# Altium project SVPXFMC_Carrier_6U.PrjPcb (part 7 of 9)

## Sheet Interface_Protection.SchDoc
size A4; Organization: Creotech Instruments; Address1: Gen. L. Okulickiego 7/9; Address2: 05-500 Piaseczno; Address3: Poland
Used 2 times, as channels Interface_prot_A, Interface_prot_B. Parts and nets are listed once, with the designators drawn on the sheet.
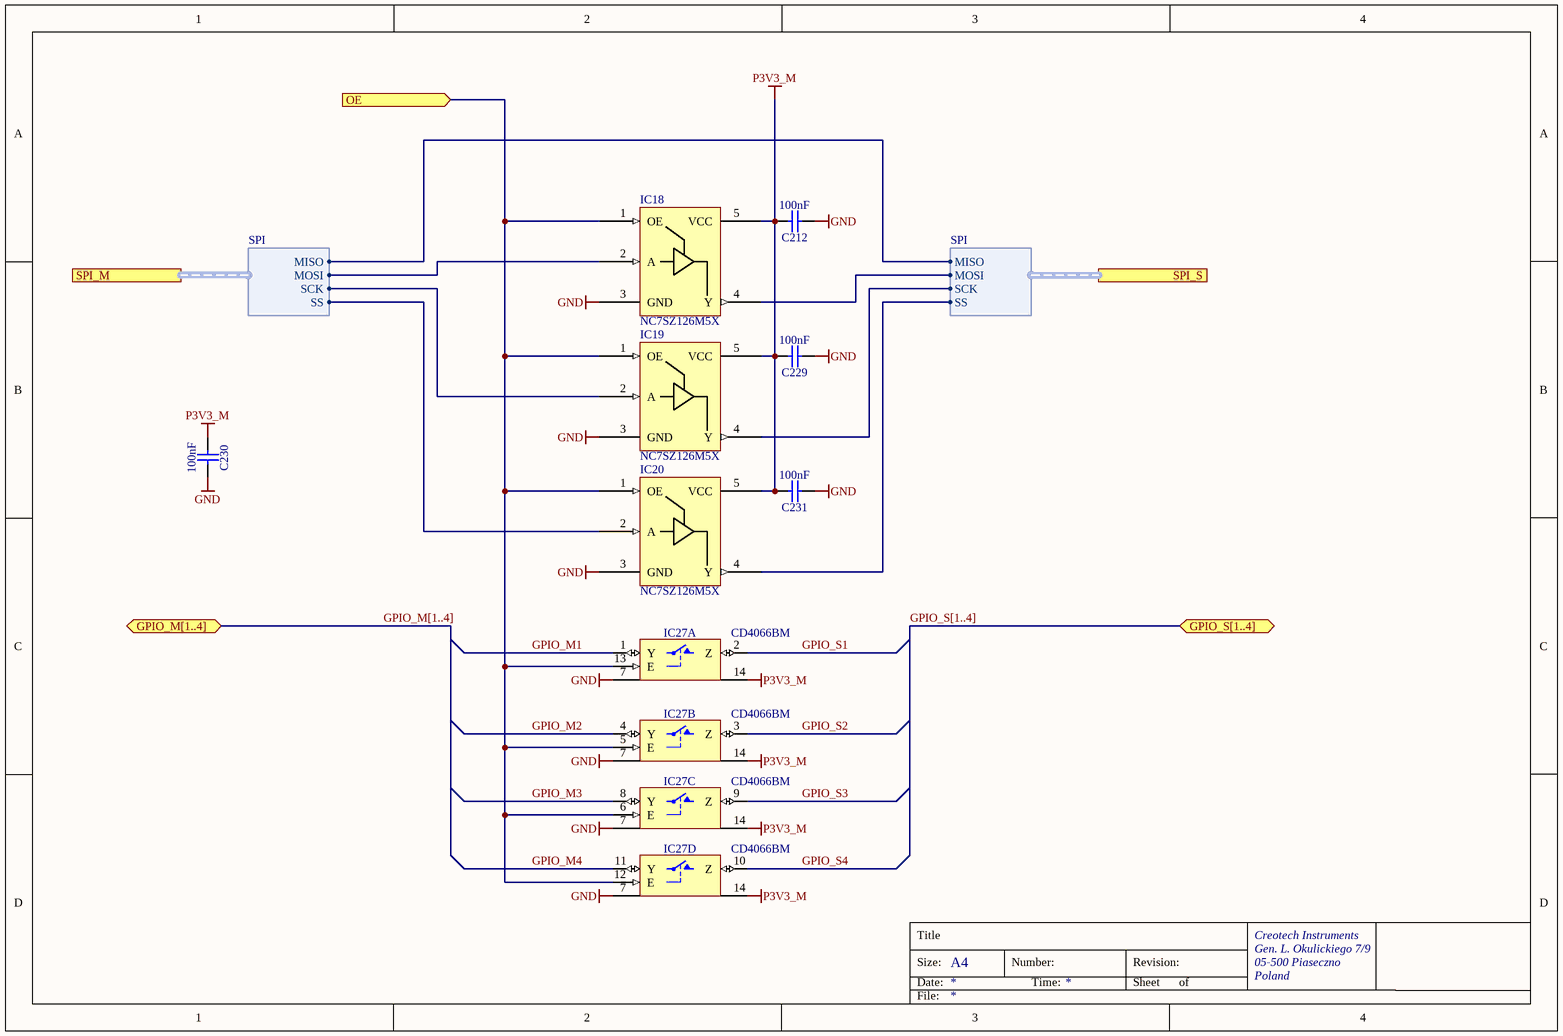
[diagram p22: Interface_Protection.SchDoc]

### Parts
C212  100nF  [CAPC1608X87N]
C229  100nF  [CAPC1608X87N]
C230  100nF  [CAPC1608X87N]
C231  100nF  [CAPC1608X87N]
IC18  NC7SZ126M5X  [SOT95P280X145-5N]
IC19  NC7SZ126M5X  [SOT95P280X145-5N]
IC20  NC7SZ126M5X  [SOT95P280X145-5N]
IC27  CD4066BM  [SOIC127P600X175-14N]  (parts A,B,C,D of 4)

### Ports
GPIO_M[1..4] (bidir), GPIO_S[1..4] (bidir), OE (in), SPI_M (harness SPI), SPI_S (harness SPI)

### Harnesses
SPI: MISO, MOSI, SCK, SS

### Nets
GND: C212.1 C229.1 C230.2 C231.1 IC18.3(GND) IC19.3(GND) IC20.3(GND) IC27.7(VSS)
P3V3_M: C212.2 C229.2 C230.1 C231.2 IC18.5(VCC) IC19.5(VCC) IC20.5(VCC) IC27.14(VDD)  [also labelled VDD]
GPIO_M1: IC27.1(Y)
GPIO_M2: IC27.4(Y)
GPIO_M3: IC27.8(Y)
GPIO_M4: IC27.11(Y)
GPIO_S1: IC27.2(Z)
GPIO_S2: IC27.3(Z)
GPIO_S3: IC27.9(Z)
GPIO_S4: IC27.10(Z)
OE: IC18.1(OE) IC19.1(OE) IC20.1(OE) IC27.5(E) IC27.6(E) IC27.12(E) IC27.13(E) ; port OE
NetIC18_2: IC18.2(A) ; port SPI_M.MOSI
NetIC18_4: IC18.4(Y) ; port SPI_S.MOSI
NetIC19_2: IC19.2(A) ; port SPI_M.SCK
NetIC19_4: IC19.4(Y) ; port SPI_S.SCK
NetIC20_2: IC20.2(A) ; port SPI_M.SS
NetIC20_4: IC20.4(Y) ; port SPI_S.SS
(unnamed): port SPI_M.MISO, port SPI_S.MISO

### Channels
Interface_prot_A: designators end in A; ports OE=P3V3_A
Interface_prot_B: designators end in B; ports OE=P3V3_B

### Buses and harness runs
bus GPIO_M[1..4] = port GPIO_M[1..4]
bus GPIO_S[1..4] = port GPIO_S[1..4]

### Notes on the sheet
- Title
- Size:
- Date:
- A4
- Number:
- Time:
- Revision:
- Sheet
- of
- File:

### Library data of the parts
C212 C229-C231 = CC0603_100NF_50V_10%_X7R: Non-polarised capacitor; Part Description: SMD Multilayer Chip Ceramic Capacitor; Manufacturer: GENERIC; Manufacturer1 Part Number: 223858615649; Voltage: 50V; TC: X7R; Tolerance: ±10%; Part Number: CC0603_100NF_50V_10%_X7R; Component Kind: Standard; Component Type: Standard; Pin Count: 2; Value: 100nF; Status: Preferred; Manufacturer Part Number: CC0603_100NF_50V_10%_X7R; Case: 0603; Mounted: Yes; Socket: No; SMD: Yes; Sense: No; Manufacturer1 Example: PHYCOMP; Manufacturer1 ComponentHeight: 0.87mm; HelpURL: \\cern.ch\dfs\Applications\Altium\Datasheets\CC0603_X7R_PHYCOMP.pdf; Author: CERN DEM JLC; CreateDate: 03.12.2007; LatestRevisionDate: 03.12.2007
IC18-IC20 = 74_NC7SZ126M5X
IC27 = CD4066BM: Part Description: CMOS Quad Bilateral Switch; Manufacturer: TEXAS INSTRUMENTS; PressFit: No; Bonding: No; Part Number: CD4066BM; Component Kind: Standard; Component Type: Standard; Device: CD4066BM; PackageDescription: SOIC 14, Pitch 1.27mm - Body 4x8.75mm, IPC Medium Density; Manufacturer Part Number: CD4066BM; Pin Count: 14; Case: SOIC14; Mounted: Yes; Socket: No; SMD: Yes; Sense: No; ComponentHeight: 1.75mm; Author: CERN DEM MR; HelpURL: \\cern.ch\dfs\Applications\Altium\Datasheets\CD4066BM.pdf; CreateDate: 2016-01-21; LatestRevisionDate: 2016-01-21